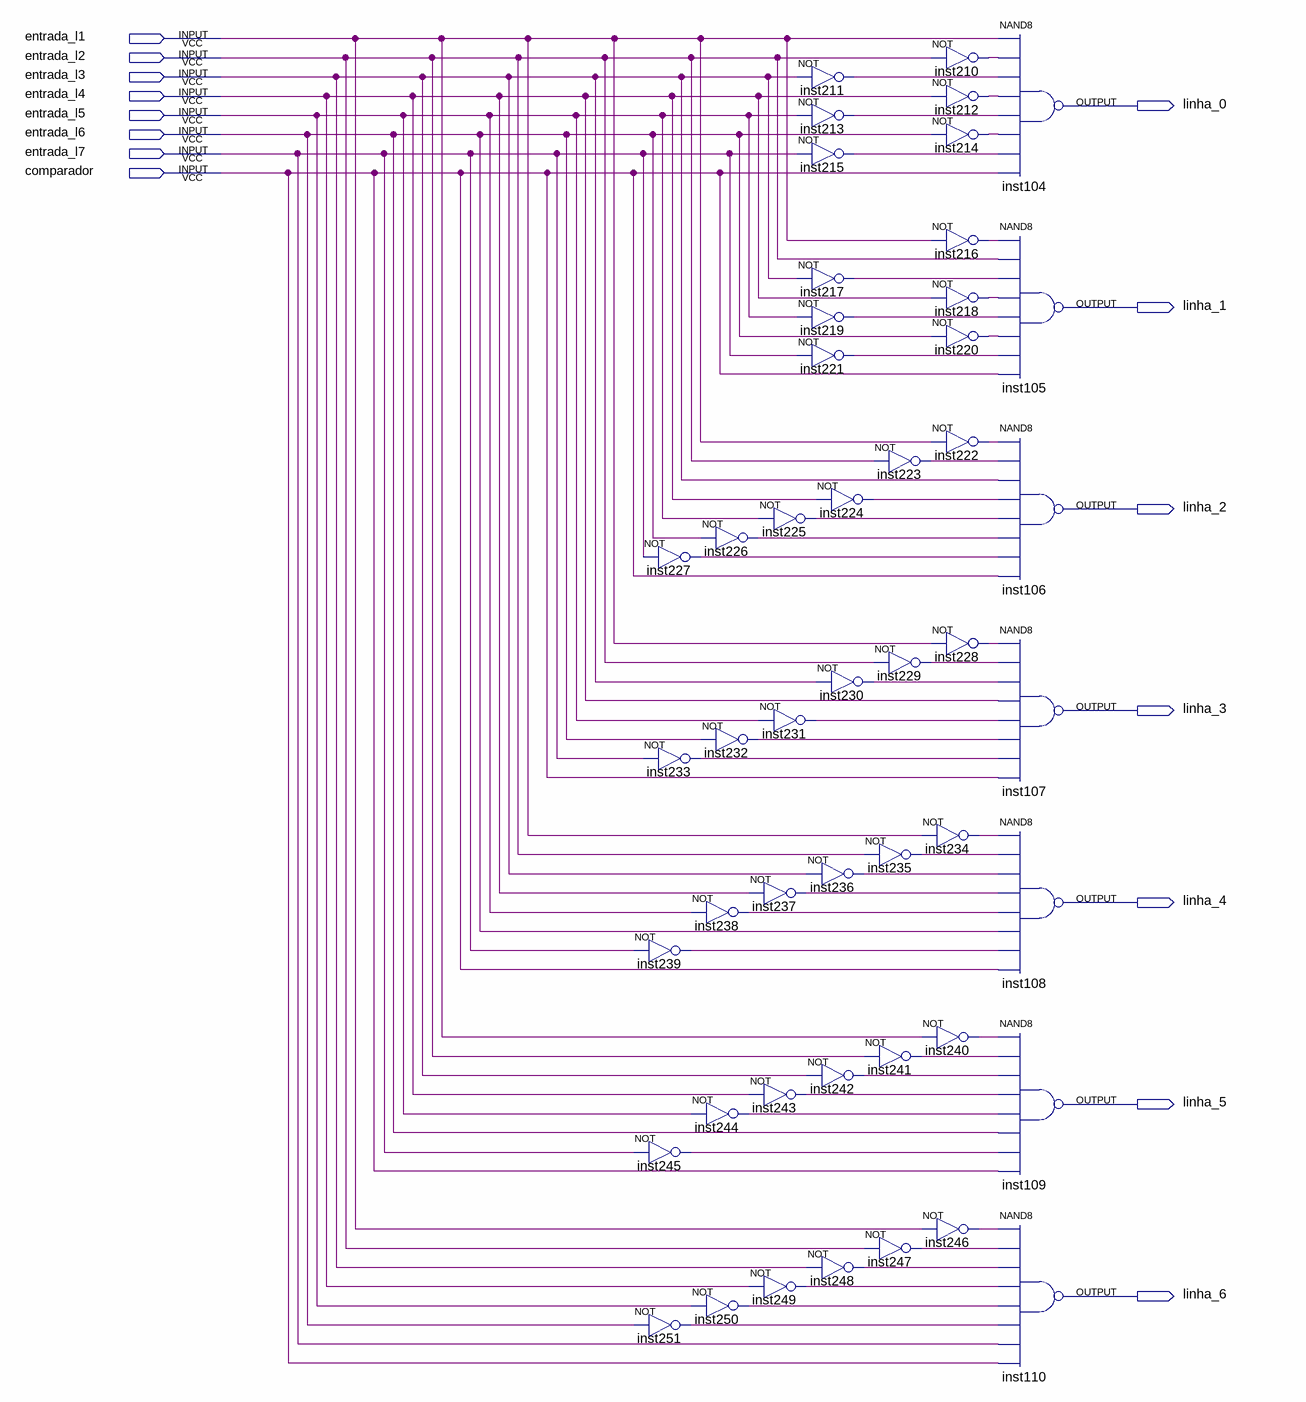
[diagram p0: schematic sheet]
// Quartus schematic decodificador12bits_linhas.bdf as structural Verilog: 49 symbols, 15 pins
module decodificador12bits_linhas (
  input  entrada_l1,
  input  entrada_l2,
  input  entrada_l3,
  input  entrada_l4,
  input  entrada_l5,
  input  entrada_l6,
  input  entrada_l7,
  input  comparador,
  output linha_0,
  output linha_1,
  output linha_2,
  output linha_3,
  output linha_4,
  output linha_5,
  output linha_6
);

  wire inst210_out, inst211_out, inst212_out, inst213_out, inst214_out, inst215_out, inst216_out,
       inst217_out, inst218_out, inst219_out, inst220_out, inst221_out, inst222_out, inst223_out,
       inst224_out, inst225_out, inst226_out, inst227_out, inst228_out, inst229_out, inst230_out,
       inst231_out, inst232_out, inst233_out, inst234_out, inst235_out, inst236_out, inst237_out,
       inst238_out, inst239_out, inst240_out, inst241_out, inst242_out, inst243_out, inst244_out,
       inst245_out, inst246_out, inst247_out, inst248_out, inst249_out, inst250_out, inst251_out;

  not inst226 (inst226_out, entrada_l6);
  not inst227 (inst227_out, entrada_l7);
  not inst232 (inst232_out, entrada_l6);
  not inst233 (inst233_out, entrada_l7);
  not inst238 (inst238_out, entrada_l5);
  not inst239 (inst239_out, entrada_l7);
  not inst244 (inst244_out, entrada_l5);
  not inst245 (inst245_out, entrada_l7);
  not inst250 (inst250_out, entrada_l5);
  not inst251 (inst251_out, entrada_l6);
  not inst225 (inst225_out, entrada_l5);
  not inst231 (inst231_out, entrada_l5);
  not inst237 (inst237_out, entrada_l4);
  not inst243 (inst243_out, entrada_l4);
  not inst249 (inst249_out, entrada_l4);
  not inst211 (inst211_out, entrada_l3);
  not inst213 (inst213_out, entrada_l5);
  not inst215 (inst215_out, entrada_l7);
  not inst217 (inst217_out, entrada_l3);
  not inst219 (inst219_out, entrada_l5);
  not inst221 (inst221_out, entrada_l7);
  not inst224 (inst224_out, entrada_l4);
  not inst230 (inst230_out, entrada_l3);
  not inst236 (inst236_out, entrada_l3);
  not inst242 (inst242_out, entrada_l3);
  not inst248 (inst248_out, entrada_l3);
  not inst210 (inst210_out, entrada_l2);
  not inst212 (inst212_out, entrada_l4);
  not inst214 (inst214_out, entrada_l6);
  not inst216 (inst216_out, entrada_l1);
  not inst218 (inst218_out, entrada_l4);
  not inst220 (inst220_out, entrada_l6);
  not inst222 (inst222_out, entrada_l1);
  not inst223 (inst223_out, entrada_l2);
  not inst228 (inst228_out, entrada_l1);
  not inst229 (inst229_out, entrada_l2);
  not inst234 (inst234_out, entrada_l1);
  not inst235 (inst235_out, entrada_l2);
  not inst240 (inst240_out, entrada_l1);
  not inst241 (inst241_out, entrada_l2);
  not inst246 (inst246_out, entrada_l1);
  not inst247 (inst247_out, entrada_l2);
  nand inst104 (linha_0, entrada_l1, inst210_out, inst211_out, inst212_out, inst213_out, inst214_out, inst215_out, comparador);
  nand inst105 (linha_1, inst216_out, entrada_l2, inst217_out, inst218_out, inst219_out, inst220_out, inst221_out, comparador);
  nand inst106 (linha_2, inst222_out, inst223_out, entrada_l3, inst224_out, inst225_out, inst226_out, inst227_out, comparador);
  nand inst107 (linha_3, inst228_out, inst229_out, inst230_out, entrada_l4, inst231_out, inst232_out, inst233_out, comparador);
  nand inst108 (linha_4, inst234_out, inst235_out, inst236_out, inst237_out, inst238_out, entrada_l6, inst239_out, comparador);
  nand inst109 (linha_5, inst240_out, inst241_out, inst242_out, inst243_out, inst244_out, entrada_l6, inst245_out, comparador);
  nand inst110 (linha_6, inst246_out, inst247_out, inst248_out, inst249_out, inst250_out, inst251_out, entrada_l7, comparador);
endmodule
